# EAGLE schematic os22s (EAGLE 7.1.0)
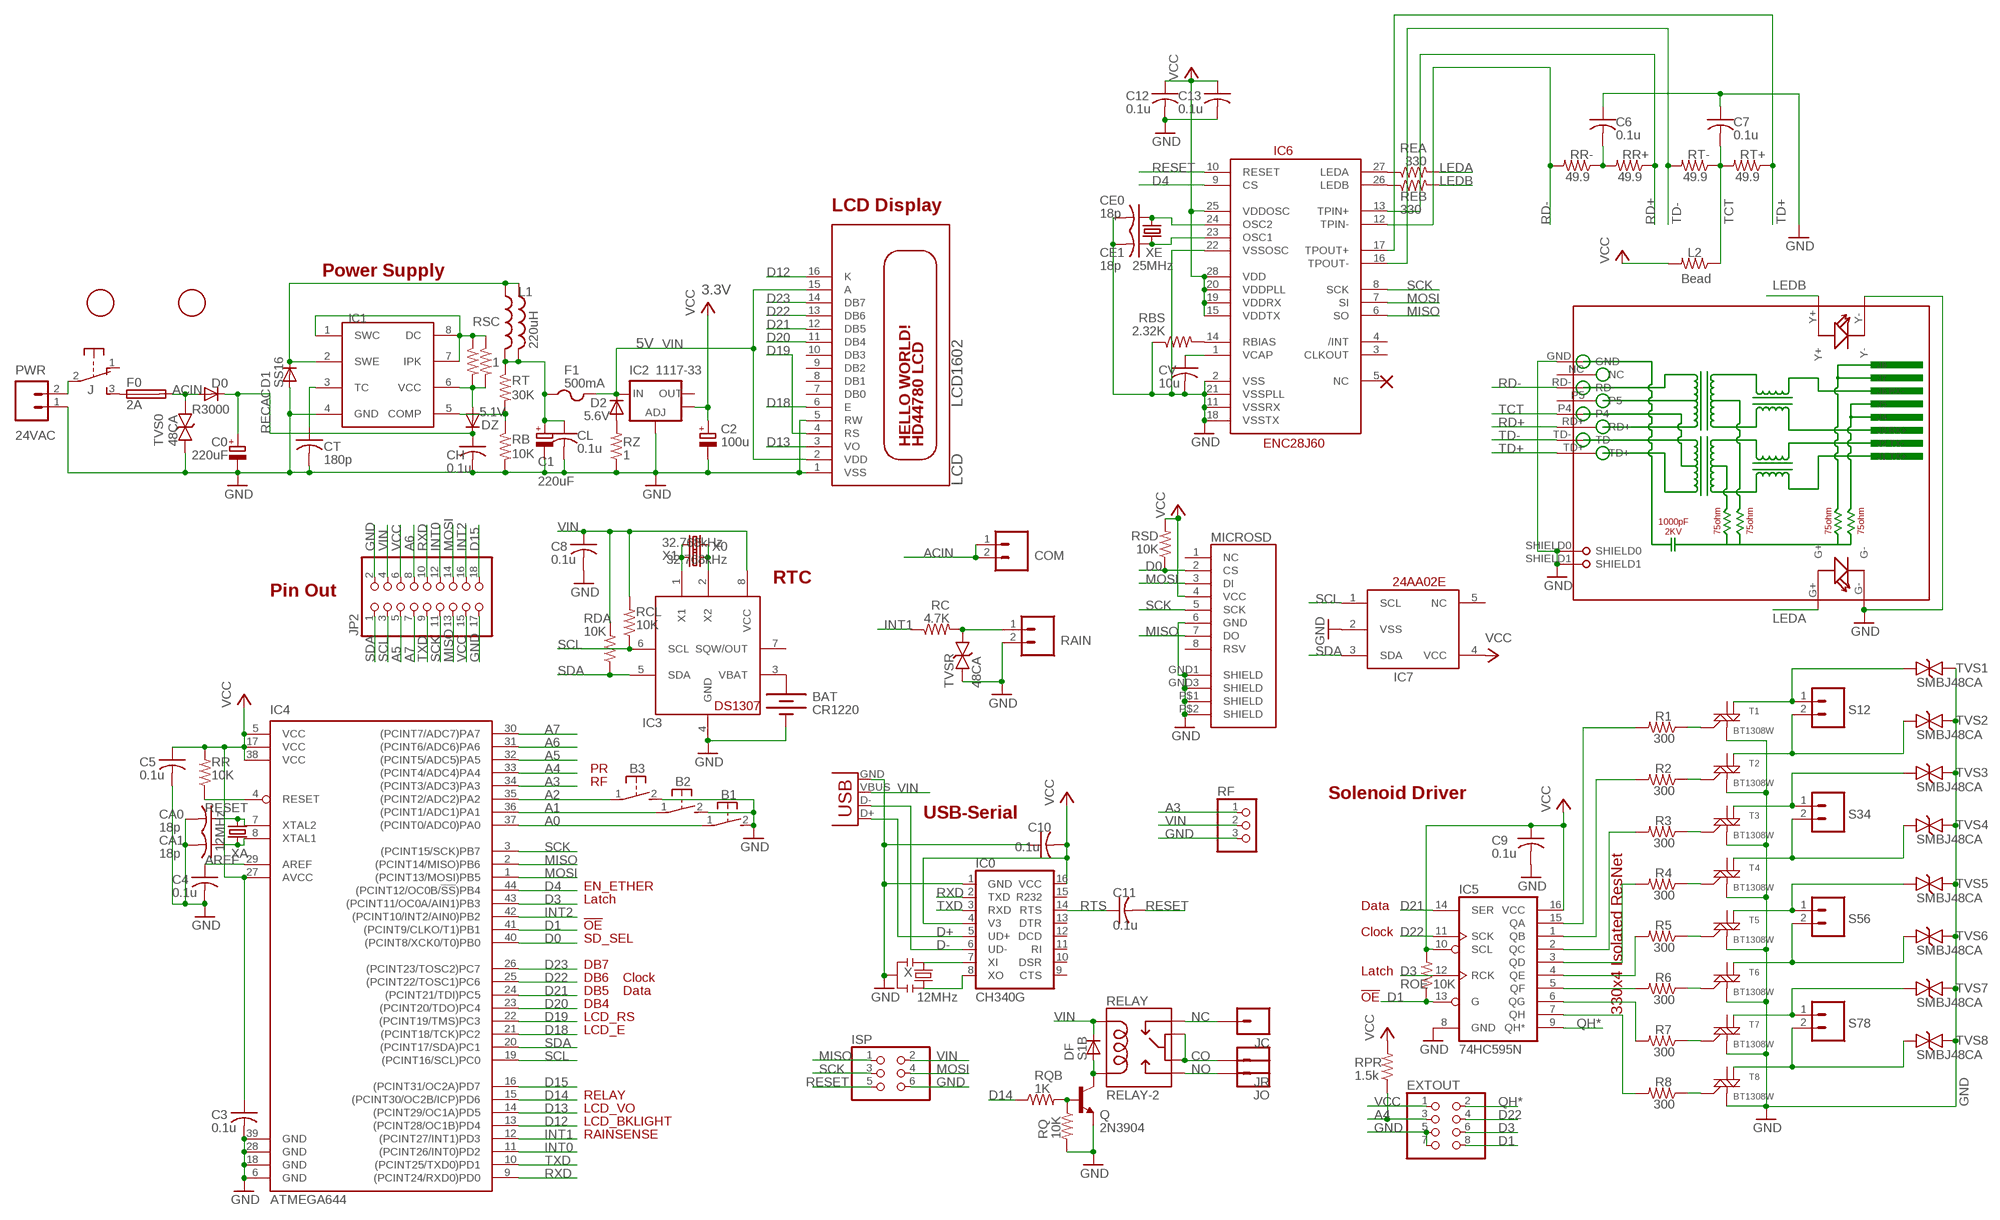
[diagram p0: schematic, sheet 1]

## Parts
B1  31-XX  [B3F-31XX]
B2  31-XX  [B3F-31XX]
B3  31-XX  [B3F-31XX]
BAT  CR1220  BATTERYBATTERY_12MM_SMT  [BATTCON_12MM_SMT]
C0  220uF  CPOL-EUE3.5-8  [E3,5-8]
C1  220uF  CPOL-EUE3.5-8  [E3,5-8]
C2  100u  CPOL-EUE2-5  [E2-5]
C3  0.1u  C-USC0603K  [C0603K]
C4  0.1u  C-USC0603  [C0603]
C5  0.1u  C-USC0603  [C0603]
C6  0.1u  C-USC0603  [C0603]
C7  0.1u  C-USC0603K  [C0603K]
C8  0.1u  C-USC0603  [C0603]
C9  0.1u  C-USC0603  [C0603]
C10  0.1u  C-USC0603  [C0603]
C11  0.1u  C-USC0603  [C0603]
C12  0.1u  C-USC0603  [C0603]
C13  0.1u  C-USC0603  [C0603]
CA0  18p  C-USC0805K  [C0805K]
CA1  18p  C-USC0805K  [C0805K]
CE0  18p  C-USC0805K  [C0805K]
CE1  18p  C-USC0805K  [C0805K]
CH  0.1u  C-USC0603  [C0603]
CL  0.1u  C-USC0603  [C0603]
COM  M025MM-X  [SCREWTERMINAL-5MM-2-X]
CT  180p  C-USC0805K  [C0805K]
CV  10u  C-USC0805K  [C0805K]
D0  R3000  DIODE-DO41-10  [DO41-10]
D1  SS16  DIODE-DO-214AC  [DO-214AC]
D2  5.6V  DIODE-MINIMELF  [MINIMELF]
DF  S1B  DIODE-DO-214AC  [DO-214AC]
DZ  5.1V  DIODE-MELF-MLL41  [MELF-MLL41]
EXTOUT  PINHD-2X4  [2X04]
F0  2A  FUSESHK20L  [SHK20L]
F1  500mA  PTCFUSE-1812  [1812]
IC0  CH340G  [SO16]
IC1  34063  MC33063/MC34063D  [SO08]
IC2  1117-33  V_REG_LM1117SOT223  [SOT223]
IC3  DS1307  DS1307SOIC  [SO08]
IC4  ATMEGA644  ATMEGA644A  [TQFP44]
IC5  74HC595N  74LS595D  [SO16]
IC6  ENC28J60  ENC28J60SO28LONG  [SOIC28WLONG]
IC7  24AA02E  24AA02E48  [SOT23-5L]
ISP  PINHD-2X3  [2X03]
J  EG1206  [EG1206]
JC  M01PTH  [1X01]
JO  M01PTH  [1X01]
JP2  PINHD-2X9-CBIG  [2X09-CLEANBIG]
JR  M01PTH  [1X01]
L1  INDUCTORPWR  [CDRH125]
L1'  220uH  L-US0204/5  [0204/5]
L2  Bead  R-US_R0805  [R0805]
LCD  LCD1602  HD44780LCDNOHOLE  [LCD1602A]
MICROSD  USD-SOCKETMICRO-SD-SOCKET-TAOBAO  [MICRO-SD-SOCKET-TAOBAO]
PWR  24VAC  M024MM-X  [SCREWTERMINAL-4MM-2-X]
Q  2N3904  TRANSISTOR_NPNSOT23-3  [SOT23-3]
R1  300  R-US_R0603  [R0603]
R2  300  R-US_R0603  [R0603]
R3  300  R-US_R0603  [R0603]
R4  300  R-US_R0603  [R0603]
R5  300  R-US_R0603  [R0603]
R6  300  R-US_R0603  [R0603]
R7  300  R-US_R0603  [R0603]
R8  300  R-US_R0603  [R0603]
RAIN  M025MM-X  [SCREWTERMINAL-5MM-2-X]
RB  10K  R-US_R0603  [R0603]
RBS  2.32K  R-US_R0805  [R0805]
RC  4.7K  R-US_R0805  [R0805]
RCL  10K  R-US_R0603  [R0603]
RDA  10K  R-US_R0603  [R0603]
REA  330  R-US_R0603  [R0603]
REB  330  R-US_R0603  [R0603]
RELAY  RELAY-2  [RELAY-HK4100F]
RF  PINHD-1X3  [1X03]
RJ45  HR911105A  [HR911105A]
ROE  10K  R-US_R0603  [R0603]
RPR  1.5k  R-US_R0805  [R0805]
RQ  10K  R-US_R0805  [R0805]
RQB  1K  R-US_R0805  [R0805]
RR  10K  R-US_R0603  [R0603]
RR+  49.9  R-US_R0805  [R0805]
RR-  49.9  R-US_R0805  [R0805]
RSC  1  R-US_R0805  [R0805]
RSC1  1  R-US_R0805  [R0805]
RSD  10K  R-US_R0603  [R0603]
RT  30K  R-US_R0805  [R0805]
RT+  49.9  R-US_R0805  [R0805]
RT-  49.9  R-US_R0805  [R0805]
RZ  1  R-US_R0805  [R0805]
S12  M025MM-X  [SCREWTERMINAL-5MM-2-X]
S34  M025MM-X  [SCREWTERMINAL-5MM-2-X]
S56  M025MM-X  [SCREWTERMINAL-5MM-2-X]
S78  M025MM-X  [SCREWTERMINAL-5MM-2-X]
T1  BT1308W  MAC97SOT223  [SOT223]
T2  BT1308W  MAC97SOT223  [SOT223]
T3  BT1308W  MAC97SOT223  [SOT223]
T4  BT1308W  MAC97SOT223  [SOT223]
T5  BT1308W  MAC97SOT223  [SOT223]
T6  BT1308W  MAC97SOT223  [SOT223]
T7  BT1308W  MAC97SOT223  [SOT223]
T8  BT1308W  MAC97SOT223  [SOT223]
TVS0  48CA  DIODE-BTVSSMB  [SMB]
TVS1  SMBJ48CA  DIODE-BTVSSMB  [SMB]
TVS2  SMBJ48CA  DIODE-BTVSSMB  [SMB]
TVS3  SMBJ48CA  DIODE-BTVSSMB  [SMB]
TVS4  SMBJ48CA  DIODE-BTVSSMB  [SMB]
TVS5  SMBJ48CA  DIODE-BTVSSMB  [SMB]
TVS6  SMBJ48CA  DIODE-BTVSSMB  [SMB]
TVS7  SMBJ48CA  DIODE-BTVSSMB  [SMB]
TVS8  SMBJ48CA  DIODE-BTVSSMB  [SMB]
TVSR  48CA  DIODE-BTVSSMB  [SMB]
U$1  FIDUCIAL  [FIDUCIAL_1MM]
U$3  FIDUCIAL  [FIDUCIAL_1MM]
USB  USBPTH  [USB-B-PTH]
X  12MHz  RESONATORSMD  [RESONATOR-SMD]
X0  32.768kHz  CRYSTALMM20SS  [MM20SS]
X1  32.768kHz  CRYSTALTC26V  [TC26V]
XA  12MHz  CRYSTALHC49U-V  [HC49U-V]
XE  25MHz  CRYSTALHC49UV  [HC49U-V]

## Nets
A0: B1.1(P) IC4.37((PCINT0/ADC0)PA0)
A1: B2.1(P) IC4.36((PCINT1/ADC1)PA1)
A2: B3.1(P) IC4.35((PCINT2/ADC2)PA2)
A3: IC4.34((PCINT3/ADC3)PA3) RF.1
A4: EXTOUT.3 IC4.33((PCINT4/ADC4)PA4) RPR.1
A5: IC4.32((PCINT5/ADC5)PA5) JP2.5
A6: IC4.31((PCINT6/ADC6)PA6) JP2.8
A7: IC4.30((PCINT7/ADC7)PA7) JP2.7
ACIN [power]: COM.1 COM.2 D0.A F0.2A TVS0.C
AREF: C4.1 IC4.29(AREF)
CO [relaypower]: JR.1 RELAY.5 RELAY.6
D0: IC4.40((PCINT8/XCK0/T0)PB0) MICROSD.2(CS) RSD.1
D1: EXTOUT.8 IC4.41((PCINT9/CLKO/T1)PB1) IC5.13(G) ROE.1
D3: EXTOUT.6 IC4.43((PCINT11/OC0A/AIN1)PB3) IC5.12(RCK)
D4: IC4.44((PCINT12/OC0B/!SS!)PB4) IC6.9(CS)
D12: IC4.13((PCINT28/OC1B)PD4) LCD.16(K)
D13: IC4.14((PCINT29/OC1A)PD5) LCD.3(VO)
D14: IC4.15((PCINT30/OC2B/ICP)PD6) RQB.1
D15: IC4.16((PCINT31/OC2A)PD7) JP2.18
D18: IC4.21((PCINT18/TCK)PC2) LCD.6(E)
D19: IC4.22((PCINT19/TMS)PC3) LCD.4(RS)
D20: IC4.23((PCINT20/TDO)PC4) LCD.11(DB4)
D21: IC4.24((PCINT21/TDI)PC5) IC5.14(SER) LCD.12(DB5)
D22: EXTOUT.4 IC4.25((PCINT22/TOSC1)PC6) IC5.11(SCK) LCD.13(DB6)
D23: IC4.26((PCINT23/TOSC2)PC7) LCD.14(DB7)
D+: IC0.5(UD+) USB.D+
D-: IC0.6(UD-) USB.D-
GND: B1.2(S) B2.2(S) B3.2(S) BAT.P$1(-) C0.- C1.- C2.- C3.2 C4.2 C5.2 C6.1 C7.1 C8.2 C9.2 C10.1 C12.2 C13.2 CA0.2 CA1.2 CE0.2 CE1.2 CH.2 CL.2 CT.2 CV.2 D1.A EXTOUT.5 EXTOUT.7 IC0.1(GND) IC1.4(GND) IC2.1(ADJ) IC3.4(GND) IC4.6(GND) IC4.18(GND) IC4.28(GND) IC4.39(GND) IC5.8(GND) IC6.2(VSS) IC6.11(VSSRX) IC6.18(VSSTX) IC6.21(VSSPLL) IC6.22(VSSOSC) IC7.2(VSS) ISP.6 JP2.2 JP2.17 LCD.1(VSS) LCD.5(RW) MICROSD.6(GND) MICROSD.GND1(SHIELD) MICROSD.GND3(SHIELD) MICROSD.P$1(SHIELD) MICROSD.P$2(SHIELD) PWR.1 Q.2(E) RAIN.2 RB.2 RBS.1 RF.3 RJ45.G- RJ45.GND RJ45.SHIELD0 RJ45.SHIELD1 RJ45.Y- RQ.2 RZ.1 T1.1(M1) T2.1(M1) T3.1(M1) T4.1(M1) T5.1(M1) T6.1(M1) T7.1(M1) T8.1(M1) TVS0.A TVS1.C TVS2.C TVS3.C TVS4.C TVS5.C TVS6.C TVS7.C TVS8.C TVSR.A USB.GND X.2
INT0: IC4.11((PCINT26/INT0)PD2) JP2.12
INT1: IC4.12((PCINT27/INT1)PD3) RC.1
INT2: IC4.42((PCINT10/INT2/AIN0)PB2) JP2.16
LEDA: REA.2 RJ45.G+
LEDB: REB.2 RJ45.Y+
MISO: IC4.2((PCINT14/MISO)PB6) IC6.6(SO) ISP.1 JP2.13 MICROSD.7(DO)
MOSI: IC4.1((PCINT13/MOSI)PB5) IC6.7(SI) ISP.4 JP2.14 MICROSD.3(DI)
N$1: J.2(P) PWR.2
N$2: Q.1(B) RQ.1 RQB.2
N$3: RAIN.1 RC.2 TVSR.C
N$4: IC5.5(QF) R6.2
N$5: IC5.6(QG) R7.2
N$6: IC0.7(XI) X.1
N$7: IC5.7(QH) R8.2
N$8: IC3.2(X2) X0.4 X1.1
N$9: F0.1A J.3(S)
N$10: IC5.4(QE) R5.2
N$11: IC5.3(QD) R4.2
N$12: IC5.2(QC) R3.2
N$13: IC5.1(QB) R2.2
N$14: IC5.15(QA) R1.2
N$15: CA0.1 IC4.7(XTAL2) XA.2
N$16 [power]: S12.1 T1.4(M2-4) TVS1.A
N$17 [power]: S12.2 T2.4(M2-4) TVS2.A
N$18 [power]: S34.1 T3.4(M2-4) TVS3.A
N$19: CA1.1 IC4.8(XTAL1) XA.1
N$20 [power]: S34.2 T4.4(M2-4) TVS4.A
N$21: R1.1 T1.3(G)
N$22 [power]: S56.1 T5.4(M2-4) TVS5.A
N$23 [power]: S56.2 T6.4(M2-4) TVS6.A
N$24 [power]: S78.1 T7.4(M2-4) TVS7.A
N$25 [power]: S78.2 T8.4(M2-4) TVS8.A
N$26: R2.1 T2.3(G)
N$27: R3.1 T3.3(G)
N$28: R4.1 T4.3(G)
N$29: R5.1 T5.3(G)
N$30: IC3.1(X1) X0.1 X1.2
N$31: R6.1 T6.3(G)
N$32: DF.A Q.3(C) RELAY.9
N$33: R7.1 T7.3(G)
N$34: IC6.27(LEDA) REA.1
N$35: R8.1 T8.3(G)
N$36: BAT.P$2(+) IC3.3(VBAT)
N$37: IC6.26(LEDB) REB.1
N$38 [power]: DZ.A IC1.6(VCC) RSC1.2 RSC.2
N$39: CV.1 IC6.1(VCAP)
N$40: IC0.8(XO) X.3
N$41: CE0.1 IC6.24(OSC2) XE.2
N$42: CE1.1 IC6.23(OSC1) XE.1
N$43: D2.A RZ.2
N$45 [power]: IC1.1(SWC) IC1.7(IPK) IC1.8(DC) RSC1.1 RSC.1
N$46 [power]: D1.C IC1.2(SWE) L1'.1 L1.1
N$49: CT.1 IC1.3(TC)
N$54: C6.2 RR+.2 RR-.1
N$55: IC1.5(COMP) RB.1 RT.2
N$59: IC6.14(RBIAS) RBS.2
NC [relaypower]: JC.1 RELAY.1
NO [relaypower]: JO.1 RELAY.10
QH*: EXTOUT.2 IC5.9(QH*)
RD+: IC6.13(TPIN+) RJ45.RD+ RR+.1
RD-: IC6.12(TPIN-) RJ45.RD- RR-.2
RECAC [power]: C0.+ CH.1 D0.C DZ.C
RESET: C11.2 IC4.4(RESET) IC6.10(RESET) ISP.5 RR.1
RTS: C11.1 IC0.14(RTS)
RXD: IC0.2(TXD) IC4.9((PCINT24/RXD0)PD0) JP2.10
SCK: IC4.3((PCINT15/SCK)PB7) IC6.8(SCK) ISP.3 JP2.11 MICROSD.5(SCK)
SCL: IC3.6(SCL) IC4.19((PCINT16/SCL)PC0) IC7.1(SCL) JP2.3 RCL.1
SDA: IC3.5(SDA) IC4.20((PCINT17/SDA)PC1) IC7.3(SDA) JP2.1 RDA.1
TCT: C7.2 L2.1 RJ45.P4 RT+.2 RT-.1
TD+: IC6.17(TPOUT+) RJ45.TD+ RT+.1
TD-: IC6.16(TPOUT-) RJ45.TD- RT-.2
TXD: IC0.3(RXD) IC4.10((PCINT25/TXD0)PD1) JP2.9
VCC: C2.+ C3.1 C5.1 C9.1 C10.2 C12.1 C13.1 EXTOUT.1 IC0.4(V3) IC0.16(VCC) IC2.4(OUT) IC4.5(VCC) IC4.17(VCC) IC4.27(AVCC) IC4.38(VCC) IC5.10(SCL) IC5.16(VCC) IC6.15(VDDTX) IC6.19(VDDRX) IC6.20(VDDPLL) IC6.25(VDDOSC) IC6.28(VDD) IC7.4(VCC) JP2.6 JP2.15 L2.2 MICROSD.4(VCC) ROE.2 RPR.2 RR.2 RSD.2
VIN [power]: C8.1 D2.C DF.C F1.2 IC2.3(IN) IC3.8(VCC) ISP.2 JP2.4 LCD.2(VDD) LCD.15(A) RCL.2 RDA.2 RELAY.2 RF.2 USB.VBUS
VIN1 [power]: C1.+ CL.1 F1.1 L1'.2 L1.2 RT.1
Unconnected: IC0.9(CTS) IC0.10(DSR) IC0.11(RI) IC0.12(DCD) IC0.13(DTR) IC0.15(R232) IC2.2(OUT) IC3.7(SQW/OUT) IC6.3(CLKOUT) IC6.4(/INT) IC6.5(NC) IC7.5(NC) J.1(O) LCD.7(DB0) LCD.8(DB1) LCD.9(DB2) LCD.10(DB3) MICROSD.1(NC) MICROSD.8(RSV) RJ45.NC RJ45.P5 T1.2(M2) T2.2(M2) T3.2(M2) T4.2(M2) T5.2(M2) T6.2(M2) T7.2(M2) T8.2(M2)

## Notes on the sheet
- LCD Display
- Power Supply
- 3.3V
- 5V
- RTC
- Pin Out
- PR
- RF
- Solenoid Driver
- USB-Serial
- EN_ETHER
- Latch
- Data
- !OE
- Clock
- SD_SEL
- DB7
- Latch
- DB6 | Clock
- DB5 | Data
- !OE
- DB4
- 330x4 Isolated ResNet
- LCD_RS
- LCD_E
- RELAY
- LCD_VO
- LCD_BKLIGHT
- RAINSENSE

## Library data of the parts
B1-B3 = adafruit:31-XX: OMRON SWITCH Now with beefier pads!
BAT = SparkFunNew:BATTERY: Battery Holders Various common sizes : AA, AAA, 20mm coin cell and 12mm coin cell.
C0 C1 C2 = resistor:CPOL-EU: POLARIZED CAPACITOR, European symbol
C3-C13 CA0 CA1 CE0 CE1 CH CL CT CV = adafruit:C-US: CAPACITOR, American symbol
COM PWR RAIN S12 S34 S56 S78 = SparkFun:M02: Header 2 Standard 2-pin 0.1" header. Use with straight break away headers (SKU : PRT-00116), right angle break away headers (PRT-00553), swiss pins (PRT-00743), machine pins (PRT-00117), and female headers (PRT-00115). Molex polarized connector foot print use with SKU : PRT-08233 with associated crimp pins and housings.
D0 D1 D2 DF DZ = diode:DIODE-: DIODE
EXTOUT = pinhead:PINHD-2X4: PIN HEADER
F0 = fuse:FUSE: Fuse; OC_FARNELL: unknown; OC_NEWARK: unknown
F1 = adafruit:PTCFUSE: PTC fuses, resettable thermistors
IC0 = SparkFunNew:CH340
IC1 = adafruit:MC33063/MC34063: MC33063 and MC34063 Basic DC/DC converter with internal power-NPN transistor, 100KHz, 1.5A peak switch current. 3-40 input/output.
IC2 = SparkFun:V_REG_LM1117: Voltage Regulator LM1117 Standard adjustable voltage regulator but in SMD form. Spark Fun Electronics SKU : COM-00595
IC3 = adafruit:DS1307: DS1307 Real time clock (RTC) with battery backup ability. Talk to it via i2c
IC4 = atmel:ATMEGA644: 8-bit Microcontroller with 64K Bytes In-System Programmable Flash Source: http://www.atmel.com/dyn/resources/prod_documents/doc2593.pdf; MPN: ATMEGA644PV-10AU; OC_FARNELL: 1455123; OC_NEWARK: 58M3748
IC5 = SparkFun:74*595: 8-bit SHIFT REGISTER, output latch
IC6 = SparkFun:ENC28J60
IC7 = adafruit:24AA02E48
ISP = pinhead:PINHD-2X3: PIN HEADER
J = adafruit:EG1206
JC JO JR = SparkFun:M01: Header 1 Standard 1-pin 0.1" header. Use with straight break away headers (SKU : PRT-00116), right angle break away headers (PRT-00553), swiss pins (PRT-00743), machine pins (PRT-00117), and female headers (PRT-00115).
JP2 = adafruit:PINHD-2X9: PIN HEADER With larger annulars
L1 = SparkFunNew:INDUCTOR: Inductors Basic Inductor/Choke - 0603 and 1206. Footprints are not proven and vary greatly between part numbers.
L1' = rcl:L-US: INDUCTOR, American symbol
L2 R1-R8 RC RCL RDA ROE RPR RQ RQB RR RSD = adafruit2013:R-US_: RESISTOR, American symbol
LCD = adafruit:HD44780LCD: HD44780 LCD Standard character type LCDs, available in sizes from 8x1 to 40x4!
MICROSD = SparkFunNew:USD-SOCKET: microSD Socket Push-push type uSD socket. Schematic element and footprint production proven. Spark Fun Electronics SKU : PRT-00127. tDoc lines correctly indicate media card edge positions when inserting (unlocked, locked, depressed).
Q = SparkFunNew:TRANSISTOR_NPN: Transistor NPN BJT configuration in SOT23 package. MMBT2222 is the common NPN we use. Double check BCE configuration again layout.
RB RBS REA REB RR+ RR- RSC RSC1 RT RT+ RT- RZ = adafruitGood:R-US_: RESISTOR, American symbol
RELAY = SparkFunNew:RELAY-2
RF = pinhead:PINHD-1X3: PIN HEADER
RJ45 = CONNECTER:HR911105A
T1-T8 = SparkFun:MAC97: MAC97 Triac http://www.onsemi.com/pub_link/Collateral/MAC97-D.PDF
TVS0 TVS1-TVS8 TVSR = diode:DIODE-BTVS
U$1 U$3 = adafruitGood:FIDUCIAL: For use by pick and place machines to calibrate the vision/machine, 1mm By microbuilder.eu
USB = SparkFunNew:USB: USB Connectors USB-B-PTH is fully proven SKU : PRT-00139 USB-miniB is fully proven SKU : PRT-00587 USB-A-PCB is untested. USB-A-H is throughly reviewed, but untested. Spark Fun Electronics SKU : PRT-00437 USB-B-SMT is throughly reviewed, but untested. Needs silkscreen touching up. USB-A-S has not been used/tested USB-MB-H has not been used/tested
X = SparkFunNew:RESONATOR: Resonator Small SMD resonator. This is the itty bitty 10/20MHz resonators with built in caps. CSTCE10M0G55 and CSTCE20M0V53. Footprint has been reviewed closely but hasn't been tested yet.
X0 X1 = crystal:CRYSTAL: CRYSTAL; OC_FARNELL: unknown; OC_NEWARK: unknown
XA = crystal:CRYSTAL: CRYSTAL; OC_FARNELL: 1666969; OC_NEWARK: unknown
XE = SparkFun:CRYSTAL: Crystals Various standard crystals. Proven footprints. Spark Fun Electronics SKU : COM-00534

## Net classes
0 default: width 0.203 mm, clearance 0.203 mm
1 power: width 0.305 mm, clearance 0.203 mm
2 relaypower: width 0.813 mm, clearance 0.305 mm